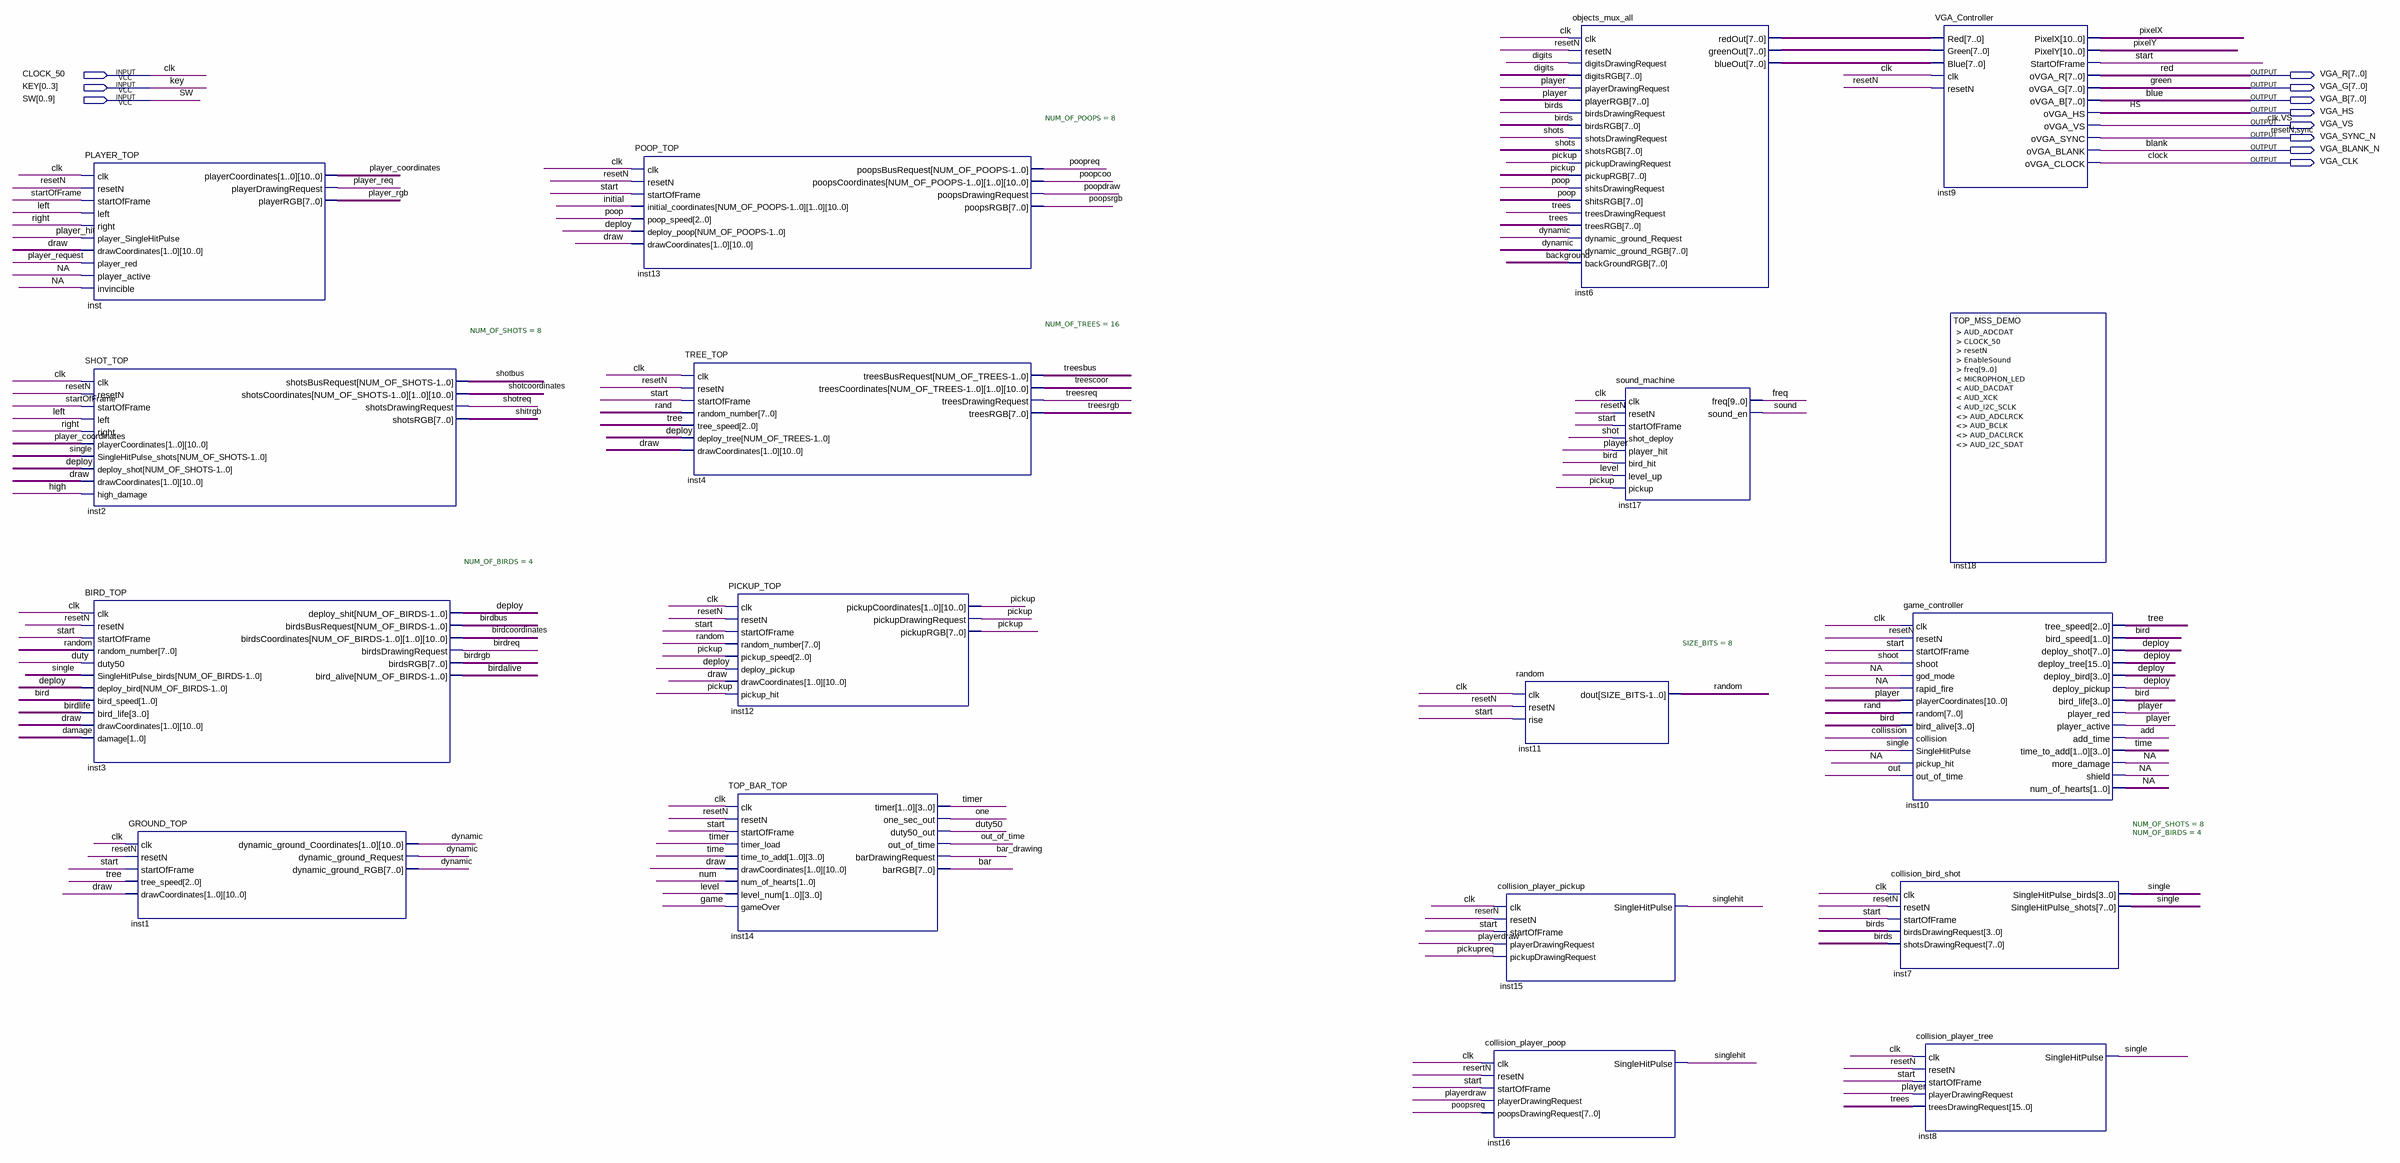
[diagram p0: schematic sheet]
// Quartus schematic Lab1Demo.bdf as structural Verilog: 18 symbols, 11 pins
module Lab1Demo (
  input  CLOCK_50,
  input  [0:3] KEY,
  input  [0:9] SW,
  output [7:0] VGA_R,
  output [7:0] VGA_G,
  output [7:0] VGA_B,
  output VGA_HS,
  output VGA_VS,
  output VGA_SYNC_N,
  output VGA_BLANK_N,
  output VGA_CLK
);

  wire add, background, bar, bar_drawing, bird, birdalive, birdbus, birdcoordinates, birdlife, birdreq,
       birdrgb, birds, blue, collission, damage, deploy, digits, draw, duty, duty50, dynamic, freq, game,
       green, high, \initial , left, level, NA, num, one, out, out_of_time, pickup, pickupreq, pixelX,
       pixelY, player, player_coordinates, player_hit, player_req, player_request, player_rgb, playerdraw,
       poop, poopcoo, poopdraw, poopreq, poopsreq, poopsrgb, \rand , random, red, reserN, resertN, resetN,
       right, shitrgb, shoot, shot, shotbus, shotcoordinates, shotreq, shots, single, singlehit, sound,
       start, startOfFrame, sync, \time , timer, tree, trees, treesbus, treescoor, treesreq, treesrgb, VS;
  wire [7:0] inst6_blueout, inst6_greenout, inst6_redout;

  PLAYER_TOP inst (
    .clk(CLOCK_50), .resetN(resetN), .startOfFrame(startOfFrame), .left(left), .right(right),
    .player_SingleHitPulse(player_hit), .drawCoordinates({22{draw}}), .player_red(player_request),
    .player_active(NA), .invincible(NA), .playerCoordinates(player_coordinates),
    .playerDrawingRequest(player_req), .playerRGB(player_rgb));
  SHOT_TOP #(.NUM_OF_SHOTS(8)) inst2 (
    .clk(CLOCK_50), .resetN(resetN), .startOfFrame(startOfFrame), .left(left), .right(right),
    .playerCoordinates({22{player_coordinates}}), .SingleHitPulse_shots({8{single}}),
    .deploy_shot({8{deploy}}), .drawCoordinates({22{draw}}), .high_damage(high), .shotsBusRequest(shotbus),
    .shotsCoordinates(shotcoordinates), .shotsDrawingRequest(shotreq), .shotsRGB(shitrgb));
  BIRD_TOP #(.NUM_OF_BIRDS(4)) inst3 (
    .clk(CLOCK_50), .resetN(resetN), .startOfFrame(start), .random_number({8{random}}), .duty50(duty),
    .SingleHitPulse_birds({4{single}}), .deploy_bird({4{deploy}}), .bird_speed({2{bird}}),
    .bird_life({4{birdlife}}), .drawCoordinates({22{draw}}), .damage({2{damage}}), .deploy_shit(deploy),
    .birdsBusRequest(birdbus), .birdsCoordinates(birdcoordinates), .birdsDrawingRequest(birdreq),
    .birdsRGB(birdrgb), .bird_alive(birdalive));
  GROUND_TOP inst1 (
    .clk(CLOCK_50), .resetN(resetN), .startOfFrame(start), .tree_speed({3{tree}}),
    .drawCoordinates({22{draw}}), .dynamic_ground_Coordinates(dynamic), .dynamic_ground_Request(dynamic),
    .dynamic_ground_RGB(dynamic));
  POOP_TOP #(.NUM_OF_POOPS(8)) inst13 (
    .clk(CLOCK_50), .resetN(resetN), .startOfFrame(start), .initial_coordinates({176{\initial }}),
    .poop_speed({3{poop}}), .deploy_poop({8{deploy}}), .drawCoordinates({22{draw}}),
    .poopsBusRequest(poopreq), .poopsCoordinates(poopcoo), .poopsDrawingRequest(poopdraw), .poopsRGB(poopsrgb));
  TREE_TOP #(.NUM_OF_TREES(16)) inst4 (
    .clk(CLOCK_50), .resetN(resetN), .startOfFrame(start), .random_number({8{\rand }}),
    .tree_speed({3{tree}}), .deploy_tree({16{deploy}}), .drawCoordinates({22{draw}}),
    .treesBusRequest(treesbus), .treesCoordinates(treescoor), .treesDrawingRequest(treesreq),
    .treesRGB(treesrgb));
  PICKUP_TOP inst12 (
    .clk(CLOCK_50), .resetN(resetN), .startOfFrame(start), .random_number({8{random}}),
    .pickup_speed({3{pickup}}), .deploy_pickup(deploy), .drawCoordinates({22{draw}}), .pickup_hit(pickup),
    .pickupCoordinates(pickup), .pickupDrawingRequest(pickup), .pickupRGB(pickup));
  TOP_BAR_TOP inst14 (
    .clk(CLOCK_50), .resetN(resetN), .startOfFrame(start), .timer_load(timer), .time_to_add({8{\time }}),
    .drawCoordinates({22{draw}}), .num_of_hearts({2{num}}), .level_num({8{level}}), .gameOver(game),
    .timer(timer), .one_sec_out(one), .duty50_out(duty50), .out_of_time(out_of_time),
    .barDrawingRequest(bar_drawing), .barRGB(bar));
  random #(.SIZE_BITS(8)) inst11 (.clk(CLOCK_50), .resetN(resetN), .rise(start), .dout(random));
  collision_player_pickup inst15 (
    .clk(CLOCK_50), .resetN(reserN), .startOfFrame(start), .playerDrawingRequest(playerdraw),
    .pickupDrawingRequest(pickupreq), .SingleHitPulse(singlehit));
  collision_player_poop inst16 (
    .clk(CLOCK_50), .resetN(resertN), .startOfFrame(start), .playerDrawingRequest(playerdraw),
    .poopsDrawingRequest({8{poopsreq}}), .SingleHitPulse(singlehit));
  objects_mux_all inst6 (
    .clk(CLOCK_50), .resetN(resetN), .digitsDrawingRequest(digits), .digitsRGB({8{digits}}),
    .playerDrawingRequest(player), .playerRGB({8{player}}), .birdsDrawingRequest(birds),
    .birdsRGB({8{birds}}), .shotsDrawingRequest(shots), .shotsRGB({8{shots}}), .pickupDrawingRequest(pickup),
    .pickupRGB({8{pickup}}), .shitsDrawingRequest(poop), .shitsRGB({8{poop}}), .treesDrawingRequest(trees),
    .treesRGB({8{trees}}), .dynamic_ground_Request(dynamic), .dynamic_ground_RGB({8{dynamic}}),
    .backGroundRGB({8{background}}), .redOut(inst6_redout), .greenOut(inst6_greenout), .blueOut(inst6_blueout));
  sound_machine inst17 (
    .clk(CLOCK_50), .resetN(resetN), .startOfFrame(start), .shot_deploy(shot), .player_hit(player),
    .bird_hit(bird), .level_up(level), .pickup(pickup), .freq(freq), .sound_en(sound));
  game_controller inst10 (
    .clk(CLOCK_50), .resetN(resetN), .startOfFrame(start), .shoot(shoot), .god_mode(NA), .rapid_fire(NA),
    .playerCoordinates({11{player}}), .random({8{\rand }}), .bird_alive({4{bird}}), .collision(collission),
    .SingleHitPulse(single), .pickup_hit(NA), .out_of_time(out), .tree_speed(tree), .bird_speed(bird),
    .deploy_shot(deploy), .deploy_tree(deploy), .deploy_bird(deploy), .deploy_pickup(deploy),
    .bird_life(bird), .player_red(player), .player_active(player), .add_time(add), .time_to_add(\time ),
    .more_damage(NA), .shield(NA), .num_of_hearts(NA));
  collision_bird_shot #(.NUM_OF_SHOTS(8), .NUM_OF_BIRDS(4)) inst7 (
    .clk(CLOCK_50), .resetN(resetN), .startOfFrame(start), .birdsDrawingRequest({4{birds}}),
    .shotsDrawingRequest({8{birds}}), .SingleHitPulse_birds(single), .SingleHitPulse_shots(single));
  collision_player_tree inst8 (
    .clk(CLOCK_50), .resetN(resetN), .startOfFrame(start), .playerDrawingRequest(player),
    .treesDrawingRequest({16{trees}}), .SingleHitPulse(single));
  VGA_Controller inst9 (
    .Red(inst6_redout), .Green(inst6_greenout), .Blue(inst6_blueout), .clk(CLOCK_50), .resetN(resetN),
    .PixelX(pixelX), .PixelY(pixelY), .StartOfFrame(start), .oVGA_R(red), .oVGA_G(green), .oVGA_B(blue),
    .oVGA_HS(VGA_HS), .oVGA_VS({CLOCK_50, VS}), .oVGA_SYNC({resetN, sync}), .oVGA_BLANK(VGA_BLANK_N),
    .oVGA_CLOCK(VGA_CLK));
  TOP_MSS_DEMO inst18 ();  // open: AUD_ADCDAT, CLOCK_50, resetN, EnableSound, freq, MICROPHON_LED, AUD_DACDAT, AUD_XCK, AUD_I2C_SCLK, AUD_ADCLRCK, AUD_BCLK, AUD_DACLRCK, AUD_I2C_SDAT

  // Other names for the same wires on the sheet: blank = VGA_BLANK_N; clk = CLOCK_50; clock = VGA_CLK; HS = VGA_HS
endmodule
